# Altium schematic sheet USB.SchDoc
size A3; SheetNumber: 8; SheetTotal: 8
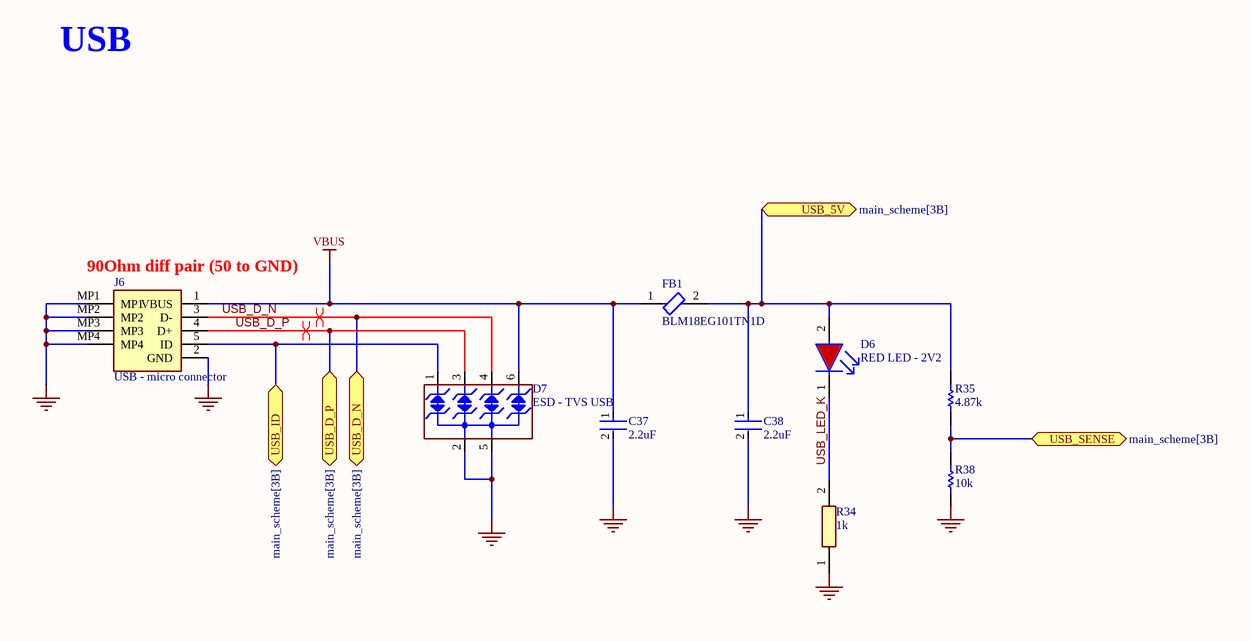
[diagram p0: USB.SchDoc]

## Parts
C37  2.2uF  [0603-CAP]
C38  2.2uF  [0603-CAP]
D6  RED LED - 2V2  [0603_RED_LED]
D7  ESD - TVS USB  [SOT23-6L]
FB1  BLM18EG101TN1D  [Ferrite_bead]
J6  USB - micro connector  [USB_micro]
R34  1k  [0603- SMD resistor]
R35  4.87k  [RESC1005X40X25NL05T05]
R38  10k  [RESC1005X40X25NL05T05]

## Ports
USB_5V (bidir, see main_scheme[3B]), USB_D_N (bidir, see main_scheme[3B]), USB_D_P (bidir, see main_scheme[3B]), USB_ID (bidir, see main_scheme[3B]), USB_SENSE (bidir, see main_scheme[3B])

## Nets
GND: C37.2 C38.2 D7.2(IO2) D7.5(IO4) J6.2(GND) J6.MP1 J6.MP2 J6.MP3 J6.MP4 R34.1 R38.2
VBUS: C37.1 D7.6(NC) FB1.1 J6.1(VBUS)
USB_5V: C38.1 D6.2(A) FB1.2 R35.1 ; port USB_5V
USB_D_N: D7.4(IO3) J6.3(D-) ; port USB_D_N
USB_D_P: D7.3(GND) J6.4(D+) ; port USB_D_P
USB_ID: D7.1(IO1) J6.5(ID) ; port USB_ID
USB_LED_K: D6.1(C) R34.2
USB_SENSE: R35.2 R38.1 ; port USB_SENSE

## Layout directives
differential pair; differential pair class USB_DIFF: USB_D_N, USB_D_P

## Notes on the sheet
- USB
- (near J6) 90Ohm diff pair (50 to GND)

## Library data of the parts
C37 C38 = CAP-0603-2.2uF: General Purpose Ceramic Capacitor, 0603,2.2uF,35V,10%; PartNumber: C1608JB1V225K080AC; ComponentLink1Description: myLinks; ComponentLink1URL: https://cz.mouser.com/ProductDetail/TDK/C1608JB1V225K080AC?qs=xLDY6iXSiQbY%2FrhN9AA4AA%3D%3D; Package: 0603; Value: 2.2uF
D6 = LED - 0603 - RED - 2V2: LED RED DIFFUSED 0603 SMD; PartNumber: SML-D12U1WT86; Value: RED LED - 2.2V; Package: 0602; ComponentLink1Description: myLinks; ComponentLink1URL: https://cz.mouser.com/ProductDetail/ROHM-Semiconductor/SML-D12U1WT86?qs=M3jcYzEJUdEySuGkbjHEtQ%3D%3D
D7 = ESD - TVS USB: 4-line ESD protection; PartNumber: ESDA6V1BC6; Value: ESD for 5V USB rails; Package: SOT-23-6; ComponentLink1Description: myLinks; ComponentLink1URL: https://cz.mouser.com/ProductDetail/STMicroelectronics/ESDA6V1BC6?qs=9PdvrqCL7oAFp2zmpu55Tw%3D%3D
FB1 = Ferrite_bead - 0603 - 100R: Chip Ferrite Bead, 0603, 100Ω @ 100MHz, 25%, 0.045Ω, 2A; Value: 100R; Package: 0603; PartNumber: BLM18EG101TN1D; ComponentLink1Description: myLinks; ComponentLink1URL: https://www.mouser.co.uk/ProductDetail/Murata-Electronics/BLM18EG101TN1D?qs=rjbY5pkpCp4yQ17nVbKqBw%3D%3D
J6 = USB-micro connector: USB Connectors USB jack, 2.0, micro B type, 5 pin, horizontal, gold flash, SMT, TRConnector; PartNumber: UJ2-MIBH-G-SMT-TR; Value: USB 2.0 Type B; ComponentLink1Description: myLinks; ComponentLink1URL: https://cz.mouser.com/ProductDetail/CUI-Devices/UJ2-MIBH-G-SMT-TR?qs=IS%252B4QmGtzzpvS1XQusp0iA%3D%3D; Package: USB 2.0 Type B
R34 = RESISTOR - 0603 - 1k: Resistor 0603 1KR 100mW 1%; PartNumber: RT0603FRE071KL; ComponentLink1Description: myLinks; ComponentLink1URL: https://cz.mouser.com/ProductDetail/YAGEO/RT0603FRE071KL?qs=8cPjvKtxWv68ZVEzoi6JxQ%3D%3D; Value: 1k; Package: 0603; Supplier 1: Mouser; Supplier Part Number 1: 603-RT0603FRE071KL
R35 = Resistor - 0402 - 4.87k: Resistor - 0402 -  4.87k - 1% - 100mW; PartNumber: ERJ-2RKF4871X; Value: 4.87k; Package: 0402; ComponentLink1Description: myLinks; ComponentLink1URL: https://cz.mouser.com/ProductDetail/Panasonic/ERJ-2RKF4871X?qs=YMBIwoNQYdV9ZzOLxQ6NUw%3D%3D
R38 = Resistor - 0402 -10k: Resistor - 0402 -  10k - 5% - 125mW; PartNumber: RC0402JR-7W10KL; Value: 10k; Package: 0402; ComponentLink1Description: myLinks; ComponentLink1URL: https://cz.mouser.com/ProductDetail/YAGEO/RC0402JR-7W10KL?qs=tggtontpCXPnY%2FhgQXv%2FLg%3D%3D